# Altium project TDA-antenna_rev2.PrjPCB
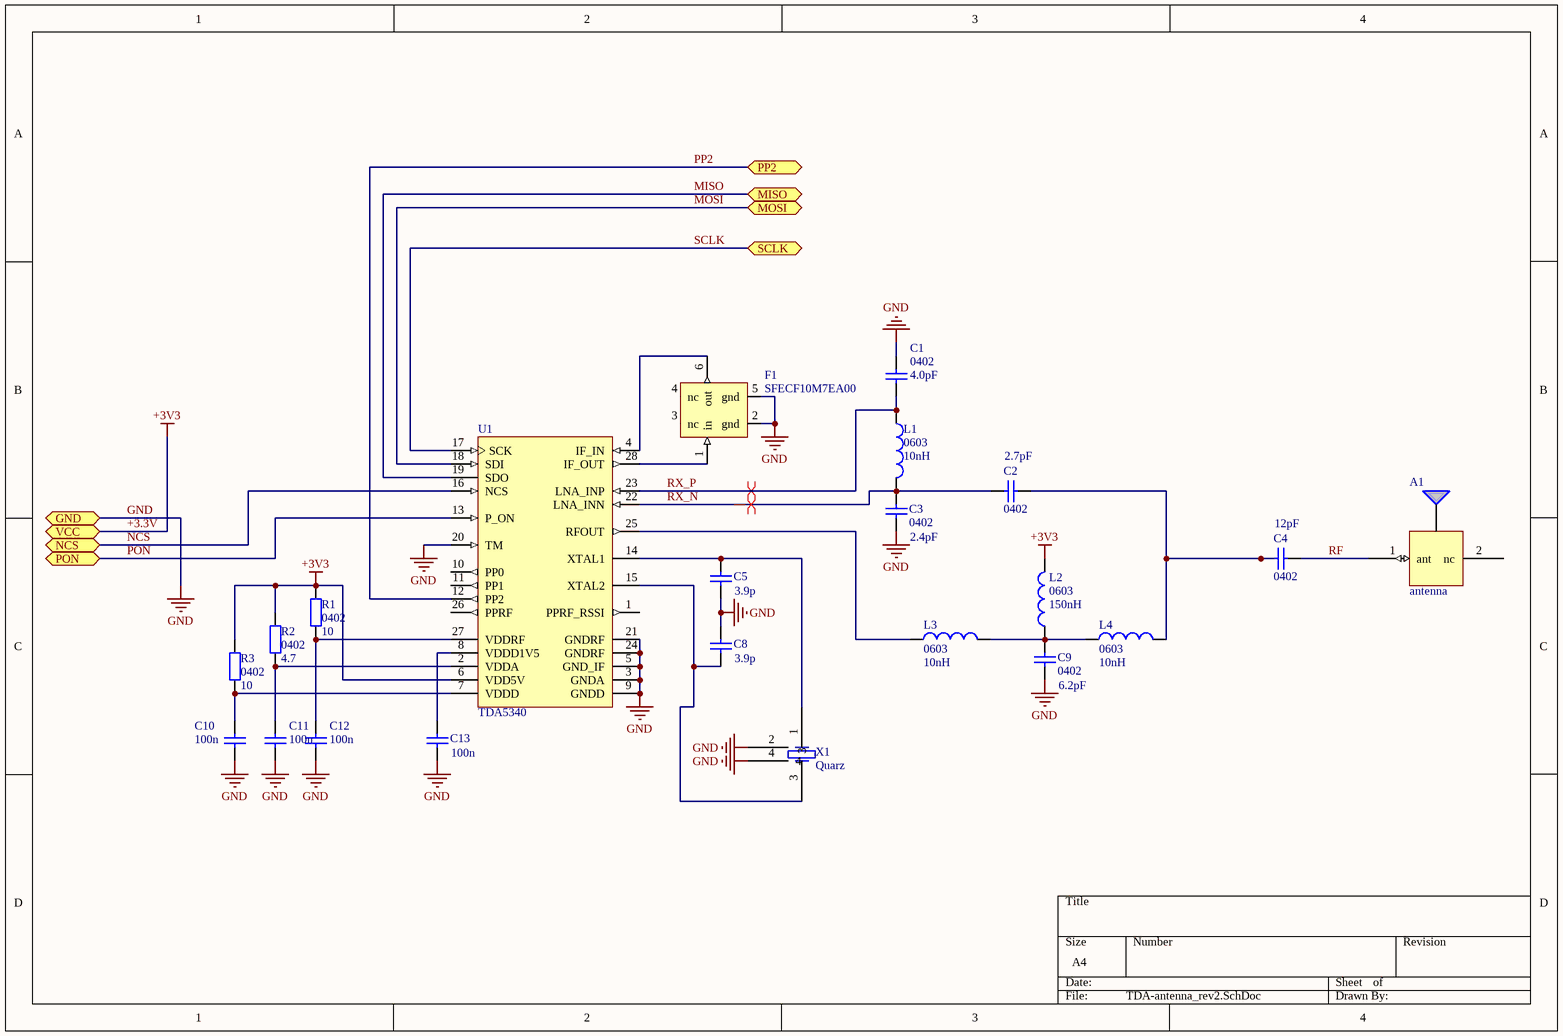
[diagram p0: TDA-antenna_rev2.SchDoc]
1 sheet, 22 parts. Net scope: flat (ports and power ports of the same name join across sheets).
Board file: TDA-antenna_rev2.PcbDoc

## Sheet TDA-antenna_rev2.SchDoc
size A4

### Parts
A1  antenna  [Chip Antenna]
C1  0402  value 4.0pF  [C0402_M]
C2  0402  value 2.7pF  [C0402_M]
C3  0402  value 2.4pF  [C0402_M]
C4  0402  value 12pF  [C0402_M]
C5  value 3.9p  [C0402_M]  (hidden comment: 0402)
C8  value 3.9p  [C0402_M]  (hidden comment: 0402)
C9  0402  value 6.2pF  [C0402_M]
C10  value 100n  [C0402_M]  (hidden comment: 0402)
C11  value 100n  [C0402_M]  (hidden comment: 0402)
C12  value 100n  [C0402_M]  (hidden comment: 0402)
C13  value 100n  [C0402_M]  (hidden comment: 0402)
F1  SFECF10M7EA00  [SOP6]
L1  0603  value 10nH  [L0603_M]
L2  0603  value 150nH  [L0603_M]
L3  0603  value 10nH  [L0603_M]
L4  0603  value 10nH  [L0603_M]
R1  0402  value 10  [R0402_M]
R2  0402  value 4.7  [R0402_M]
R3  0402  value 10  [R0402_M]
U1  TDA5340  [INF-PG-TSSOP-28_L]
X1  Quarz  [Quarz]

### Ports
GND, MISO, MOSI, NCS, PON, PP2, SCLK, VCC

### Nets
+3.3V: L2.2 R1.2 R2.2 R3.1 U1.6(VDD5V) ; port VCC  [also labelled +3V3]
GND: C1.2 C3.1 C5.1 C8.2 C9.2 C10.1 C11.1 C12.1 C13.1 F1.2(gnd) F1.5(gnd) U1.3(GNDA) U1.5(GND_IF) U1.9(GNDD) U1.20(TM) U1.21(GNDRF) U1.24(GNDRF) X1.2 X1.4 ; port GND
MISO: U1.19(SDO) ; port MISO
MOSI: U1.18(SDI) ; port MOSI
NCS: U1.16(NCS) ; port NCS
PON: U1.13(P_ON) ; port PON
PP2: U1.12(PP2) ; port PP2
RF: A1.1(ant) C4.2
RX_N: C2.2 C3.2 L1.2 U1.22(LNA_INN)
RX_P: C1.1 L1.1 U1.23(LNA_INP)
SCLK: U1.17(SCK) ; port SCLK
NetC2_1: C2.1 C4.1 L4.2
NetC5_2: C5.2 U1.14(XTAL1) X1.1
NetC8_1: C8.1 U1.15(XTAL2) X1.3
NetC9_1: C9.1 L2.1 L3.2 L4.1
NetC10_2: C10.2 R3.2 U1.7(VDDD)
NetC11_2: C11.2 R2.1 U1.2(VDDA)
NetC12_2: C12.2 R1.1 U1.27(VDDRF)
NetC13_2: C13.2 U1.8(VDDD1V5)
NetF1_1: F1.1(in) U1.28(IF_OUT)
NetF1_6: F1.6(out) U1.4(IF_IN)
NetL3_1: L3.1 U1.25(RFOUT)

Not connected (* = marked no-connect by the designer): A1 2(nc); F1 3(nc) 4(nc); U1 1(PPRF_RSSI) 10(PP0) 11(PP1) 26(PPRF)

### Layout directives
differential pair: RX_N, RX_P

### Library data of the parts
C1-C5 C8-C13 = Cap0402: Capacitor; Kind: General; Part Number: Cap0402; Type: Capacitor
L1-L4 = Ind0603: Inductor; Kind: General; Part Number: Ind0603; Type: Inductor
R1-R3 = Res0402: Resistor; Kind: General; Part Number: Res0402; Type: Resistor
U1 = CMP-1173-00001-1: High Sensitivity Multi-Channel Transceiver, -40 to 110 degC, PG-TSSOP-28, Green; Manufacturer: Infineon; Modulation Type: ASK / FSK / GSFK; Group: SmartLEWIS TRX to Multi-channel TRX with Digital Baseband Processing; Frequency Band: 315 MHz, 434 MHz, 470 MHz, 868 MHz, 915 MHz, 959 MHz; Transmit Power (at 3V): 14 dBm; Green: yes; Mounting Technology: Surface Mount; PartNumber: TDA5340; ComponentLink1URL: http://www.infineon.com/; Halogen-free: yes; ComponentLink2URL: http://www.infineon.com/dgdl/TDA5340_DS_V1.2.pdf?folderId=db3a3043191a246301192dd387ea2ae3&fileId=db3a30433408410401340ea9a6a4300a; Channel Requirements per Band: Multi-Channel; ComponentLink3URL: http://www.infineon.com/cms/packages/SMD_-_Surface_Mounted_Devices/P-PG-TSSOP/P-PG-TSSOP-28-1x_-4x_-8.html?__locale=en; PackageReference: PG-TSSOP-28; ComponentLink1Description: Manufacturer URL; PackageDescription: 28-Pin Plastic (Green) Thin Shrink Small Outline Package, 9.7 x 4.4 mm Body, 0.65 mm Pitch; ComponentLink3Description: Package Specification; DatasheetVersion: Rev. 1.2; ComponentLink2Description: Datasheet